# Altium project H3_PROTOTYPE_DDR3_16X2_V3_0_20141113.PrjPcb (part 2 of 2)
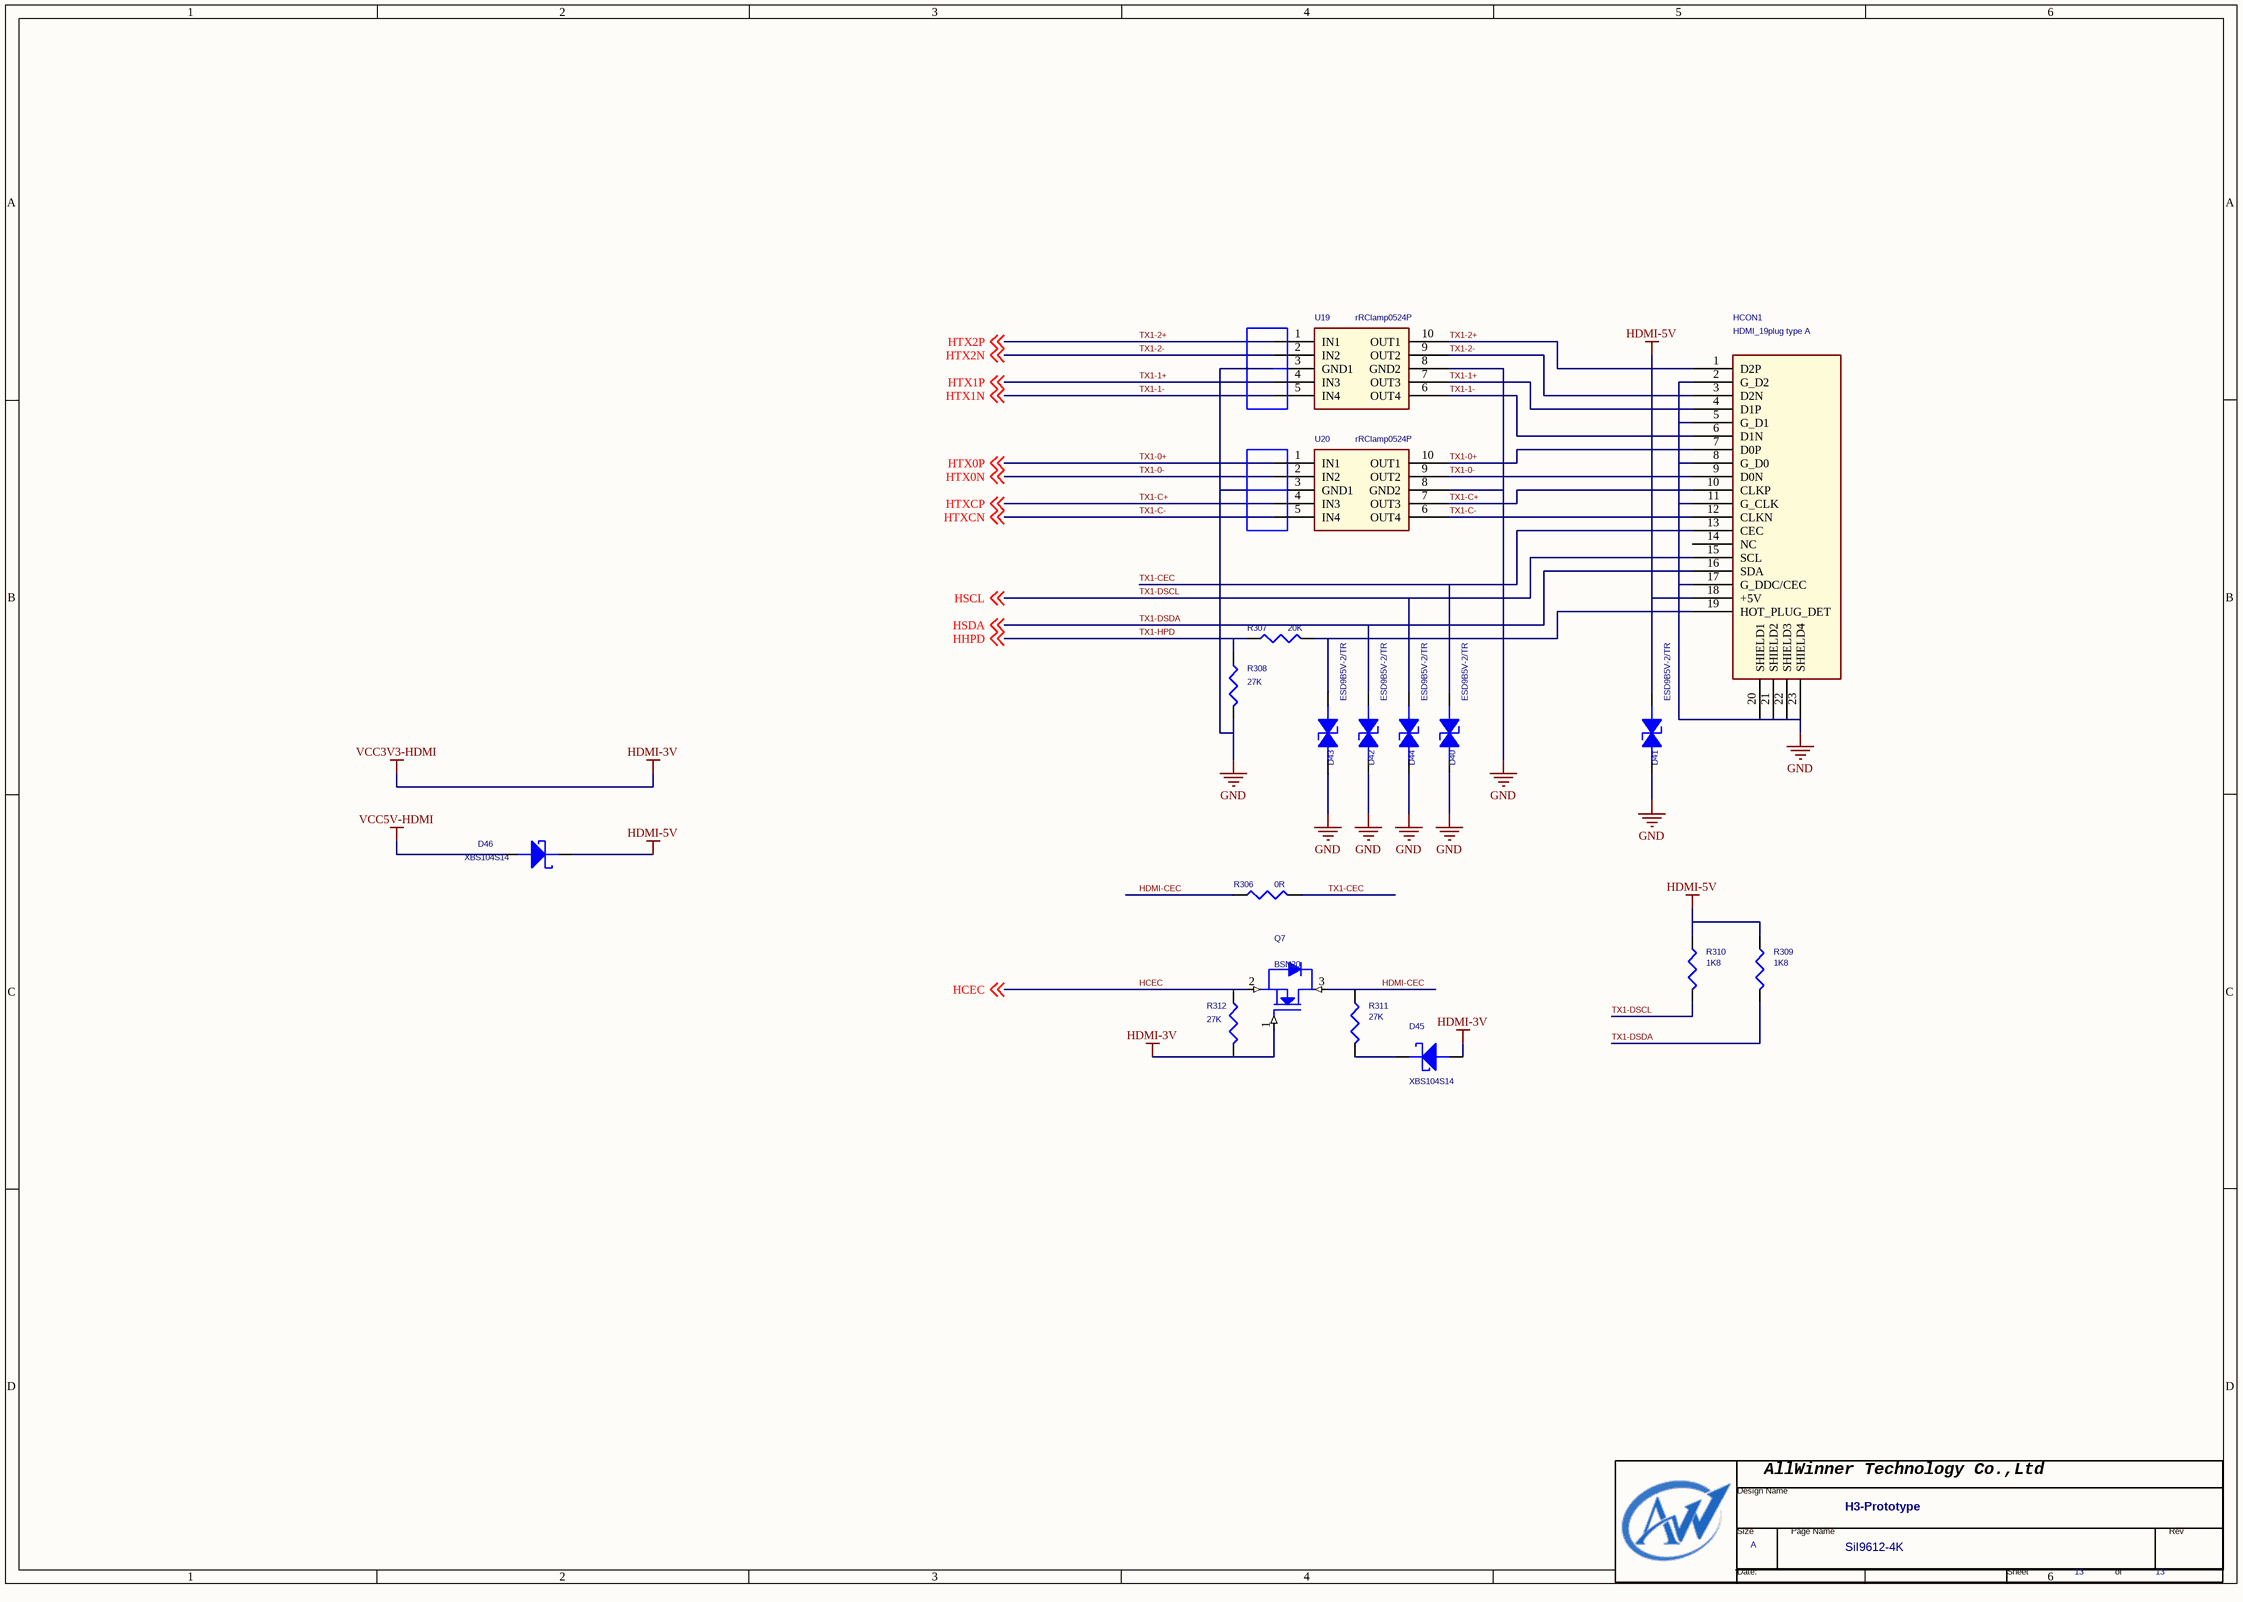
[diagram p15: 13 HDMI.SchDoc]

## Nets that join several sheets
AVCC: 06 CPU (5 pins), 07 POWER (R33.1 R34.1 R330.2)
GND: 05 DDR3 16X2 (121 pins), 06 CPU (45 pins), 07 POWER (60 pins), 08 NAND-eMMC (30 pins), 09 CARD-USB-WIFI (48 pins), 10 AV-SPDIF (22 pins), 11 MISC (13 pins), 12 FE-DBG (6 pins), 13 HDMI (19 pins)
HDMI-3V: 06 CPU (19 pins), 07 POWER (R11.2 R20.1), 08 NAND-eMMC (29 pins), 09 CARD-USB-WIFI (R50.1 R51.1 R52.1), 10 AV-SPDIF (FB1.2), 11 MISC (R77.2), 12 FE-DBG (6 pins), 13 HDMI (D45.A Q7.1 R312.2)
SPDIF-5V: 07 POWER (27 pins), 09 CARD-USB-WIFI (6 pins), 10 AV-SPDIF (C103.1 D18.1 J4.2), 13 HDMI (D46.A)
VCC3V-PLL: 06 CPU (C4.2 U1.N3), 07 POWER (R33.2)
VCC3V-TV: 06 CPU (C8.1 U1.G9), 07 POWER (R34.2)
VCC-DRAM: 05 DDR3 16X2 (70 pins), 07 POWER (R10.2)
VCC-IR: 06 CPU (8 pins), 07 POWER (R25.2 R31.2 R32.2), 11 MISC (6 pins)
VCC-WIFI-IO: 07 POWER (R20.2 R339.2), 09 CARD-USB-WIFI (C295.1 C296.1 Q4.2 R226.2)
VDD1V1-EPHY: 06 CPU (C7.2 U1.F8), 07 POWER (R24.2)
VDD1V2-SYS: 06 CPU (17 pins), 07 POWER (R21.2)
VDD-CPUX: 06 CPU (18 pins), 07 POWER (R231.2)
CPUX-TCK: 06 CPU (U1.D5), 12 FE-DBG (TP6.1)
CPUX-TDI: 06 CPU (U1.E13), 12 FE-DBG (TP5.1)
CPUX-TDO: 06 CPU (U1.D6), 12 FE-DBG (TP7.1)
CPUX-TMS: 06 CPU (U1.D11), 12 FE-DBG (TP8.1)
CPUX-URX: 06 CPU (U1.H6), 12 FE-DBG (Q3.2 R91.2)
CPUX-UTX: 06 CPU (U1.F5), 12 FE-DBG (Q2.2 R90.1)
EPHY-LINK-LED: 06 CPU (C289.2 U1.A2), 12 FE-DBG (C288.2 J8.16)
EPHY-RXN: 06 CPU (U1.A4), 12 FE-DBG (U22.8)
EPHY-RXP: 06 CPU (U1.B4), 12 FE-DBG (U22.6)
EPHY-SPD-LED: 06 CPU (C290.2 U1.F7), 12 FE-DBG (C287.2 J8.14)
EPHY-TXN: 06 CPU (U1.A3), 12 FE-DBG (U22.3)
EPHY-TXP: 06 CPU (U1.B3), 12 FE-DBG (U22.1)
HCEC: 06 CPU (U1.G5), 13 HDMI (Q7.2 R312.1)
IR-RX: 06 CPU (U1.U2), 11 MISC (ESD21.1 J9.1 R80.1 U21.1)
LINEOUTL: 06 CPU (U1.AA3), 10 AV-SPDIF (C99.2)
LINEOUTR: 06 CPU (U1.Y3), 10 AV-SPDIF (C94.2)
MUTE: 06 CPU (U1.D15), 10 AV-SPDIF (R63.1)
PWR-DRAM: 06 CPU (U1.M6), 07 POWER (R32.1 U4.1)
PWR-LED: 06 CPU (U1.V2), 11 MISC (R324.1 R326.1)
PWR-STB: 06 CPU (U1.T2), 07 POWER (R31.1 U7.1 U31.12 U49.3)
RECOVERY: 06 CPU (U1.N2), 11 MISC (R77.1 U48.1)
S-TWI-SCK: 06 CPU (R228.1 U1.N1), 07 POWER (U31.9)
S-TWI-SDA: 06 CPU (R227.1 U1.M1), 07 POWER (U31.10)
SDC0-CLK: 06 CPU (U1.D20), 09 CARD-USB-WIFI (R53.1)
SDC0-CMD: 06 CPU (U1.F18), 09 CARD-USB-WIFI (D4.1 J2.3 R51.2)
SDC0-D0: 06 CPU (U1.A19), 09 CARD-USB-WIFI (D6.1 J2.7)
SDC0-D1: 06 CPU (U1.D19), 09 CARD-USB-WIFI (D7.1 J2.8)
SDC0-D2: 06 CPU (U1.C20), 09 CARD-USB-WIFI (D2.1 J2.1)
SDC0-D3: 06 CPU (U1.E21), 09 CARD-USB-WIFI (D3.1 J2.2 R54.2)
SDC0-DET: 06 CPU (U1.G18), 09 CARD-USB-WIFI (D8.1 J2.9 R52.2)
SPDIF-OUT: 06 CPU (U1.C14), 10 AV-SPDIF (D30.1 J4.1)
STATUS-LED: 06 CPU (U1.F14), 11 MISC (R325.1 R327.1)
TV-OUT: 06 CPU (U1.F10), 10 AV-SPDIF (C101.2 L4.1 R70.1)
TX1-0+: 06 CPU (U1.G1), 13 HDMI (HCON1.7 U20.1 U20.10)
TX1-0-: 06 CPU (U1.F1), 13 HDMI (HCON1.9 U20.2 U20.9)
TX1-1+: 06 CPU (U1.H2), 13 HDMI (HCON1.4 U19.4 U19.7)
TX1-1-: 06 CPU (U1.G2), 13 HDMI (HCON1.6 U19.5 U19.6)
TX1-2+: 06 CPU (U1.J1), 13 HDMI (HCON1.1 U19.1 U19.10)
TX1-2-: 06 CPU (U1.J2), 13 HDMI (HCON1.3 U19.2 U19.9)
TX1-C+: 06 CPU (U1.F2), 13 HDMI (HCON1.10 U20.4 U20.7)
TX1-C-: 06 CPU (U1.E2), 13 HDMI (HCON1.12 U20.5 U20.6)
TX1-DSCL: 06 CPU (U1.H3), 13 HDMI (D44.1 HCON1.15 R310.1)
TX1-DSDA: 06 CPU (U1.K3), 13 HDMI (D42.1 HCON1.16 R309.1)
TX1-HPD: 06 CPU (U1.M2), 13 HDMI (R307.1 R308.1)
UBOOT: 06 CPU (U1.W6), 11 MISC (R78.1 SW1.1 SW2.4 U51.2)
USB0-DRVVBUS: 06 CPU (U1.P2), 09 CARD-USB-WIFI (R55.2 U12.4)
USB1-DRVVBUS: 06 CPU (U1.R1), 09 CARD-USB-WIFI (R57.2 U13.4)
USB-DM0: 06 CPU (U1.B5), 09 CARD-USB-WIFI (L13.4 R176.2)
USB-DM1: 06 CPU (U1.B7), 09 CARD-USB-WIFI (L14.3 R335.2)
USB-DM3: 06 CPU (U1.B9), 09 CARD-USB-WIFI (U14.4)
USB-DP0: 06 CPU (U1.A5), 09 CARD-USB-WIFI (L13.3 R333.2)
USB-DP1: 06 CPU (U1.B6), 09 CARD-USB-WIFI (L14.4 R334.2)
USB-DP3: 06 CPU (U1.B8), 09 CARD-USB-WIFI (U14.3)
VCC-IO-EN: 06 CPU (U1.R2), 07 POWER (Q6.1 R234.2)
VDD-CPUFB: 06 CPU (TP1.1 U1.T10), 07 POWER (C174.2 R229.2)
WIFI-EN: 06 CPU (U1.T3), 09 CARD-USB-WIFI (R337.1)